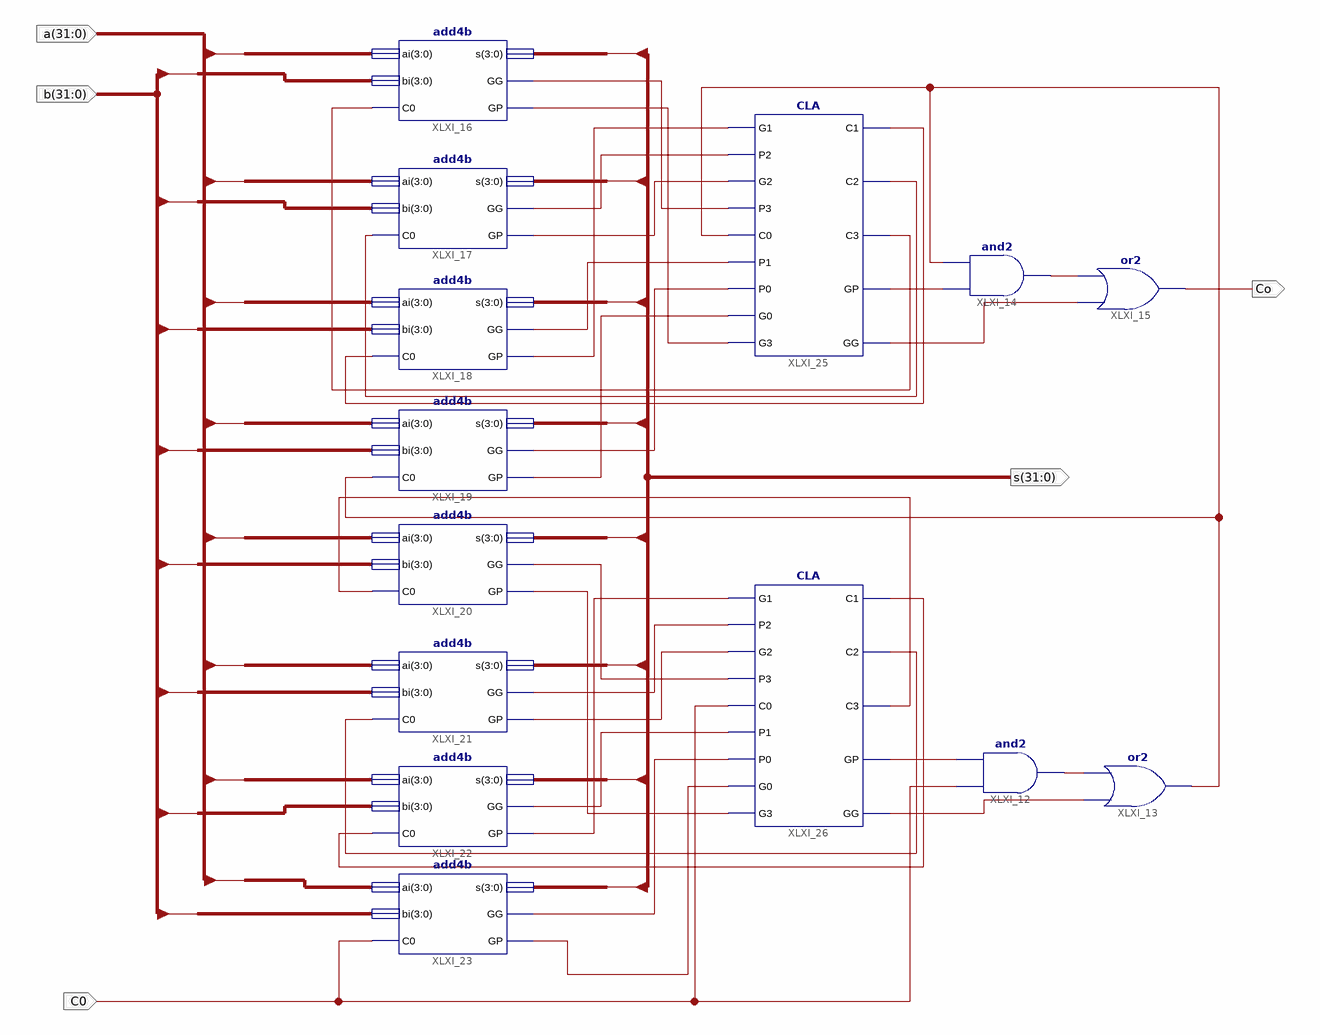
[diagram p0: schematic sheet 1]
// Xilinx ISE schematic ADC32.sch (kintex7) as structural Verilog: 14 symbols, 5 ports
module ADC32 (
  input  [31:0] a,
  input  [31:0] b,
  input  C0,
  output [31:0] s,
  output Co
);

  wire XLXN_34, XLXN_35, XLXN_36, XLXN_37, XLXN_38, XLXN_39, XLXN_40, XLXN_41, XLXN_42, XLXN_43, XLXN_44,
       XLXN_47, XLXN_48, XLXN_49, XLXN_53, XLXN_54, XLXN_55, XLXN_56, XLXN_57, XLXN_58, XLXN_59, XLXN_60,
       XLXN_61, XLXN_62, XLXN_63, XLXN_64, XLXN_65, XLXN_66, XLXN_67;

  and XLXI_12 (XLXN_48, C0, XLXN_47);
  or XLXI_13 (XLXN_65, XLXN_49, XLXN_48);
  and XLXI_14 (XLXN_66, XLXN_64, XLXN_65);
  or XLXI_15 (Co, XLXN_67, XLXN_66);
  add4b XLXI_16 (.ai(a[31:28]), .bi(b[31:28]), .C0(XLXN_63), .s(s[31:28]), .GG(XLXN_59), .GP(XLXN_60));
  add4b XLXI_17 (.ai(a[27:24]), .bi(b[27:24]), .C0(XLXN_62), .s(s[27:24]), .GG(XLXN_58), .GP(XLXN_57));
  add4b XLXI_18 (.ai(a[23:20]), .bi(b[23:20]), .C0(XLXN_61), .s(s[23:20]), .GG(XLXN_56), .GP(XLXN_55));
  add4b XLXI_19 (.ai(a[19:16]), .bi(b[19:16]), .C0(XLXN_65), .s(s[19:16]), .GG(XLXN_53), .GP(XLXN_54));
  add4b XLXI_20 (.ai(a[15:12]), .bi(b[15:12]), .C0(XLXN_44), .s(s[15:12]), .GG(XLXN_40), .GP(XLXN_41));
  add4b XLXI_21 (.ai(a[11:8]), .bi(b[11:8]), .C0(XLXN_43), .s(s[11:8]), .GG(XLXN_38), .GP(XLXN_39));
  add4b XLXI_22 (.ai(a[7:4]), .bi(b[7:4]), .C0(XLXN_42), .s(s[7:4]), .GG(XLXN_36), .GP(XLXN_37));
  add4b XLXI_23 (.ai(a[3:0]), .bi(b[3:0]), .C0(C0), .s(s[3:0]), .GG(XLXN_34), .GP(XLXN_35));
  CLA XLXI_25 (
    .G1(XLXN_55), .P2(XLXN_58), .G2(XLXN_57), .P3(XLXN_59), .C0(XLXN_65), .P1(XLXN_56), .P0(XLXN_53),
    .G0(XLXN_54), .G3(XLXN_60), .C1(XLXN_61), .C2(XLXN_62), .C3(XLXN_63), .GP(XLXN_64), .GG(XLXN_67));
  CLA XLXI_26 (
    .G1(XLXN_37), .P2(XLXN_38), .G2(XLXN_39), .P3(XLXN_40), .C0(C0), .P1(XLXN_36), .P0(XLXN_34),
    .G0(XLXN_35), .G3(XLXN_41), .C1(XLXN_42), .C2(XLXN_43), .C3(XLXN_44), .GP(XLXN_47), .GG(XLXN_49));
endmodule
